# Altium schematic sheet ST_LINK_V3E.SchDoc: STLINK_V3E
size OrCAD A; Date: Not used; ApprovedBy: Not used; CheckedBy: Not used; Author: Not used; CompanyName: STMicroelectronics; DrawnBy: Not used; Engineer: Not used; Organization: Not used; Address1: Not used; Address2: Not used; Address3: Not used; Address4: Not used; DocumentNumber: 10; Revision: Not used; SheetNumber: 9; SheetTotal: 9; CurrentTime: Not used; CurrentDate: Not used; Time: Not used; DocumentFullPathAndName: Not used; DocumentName: Not used; ModifiedDate: Not used; ImagePath: Not used; ProjectName: Not used; Application_BuildNumber: Not used
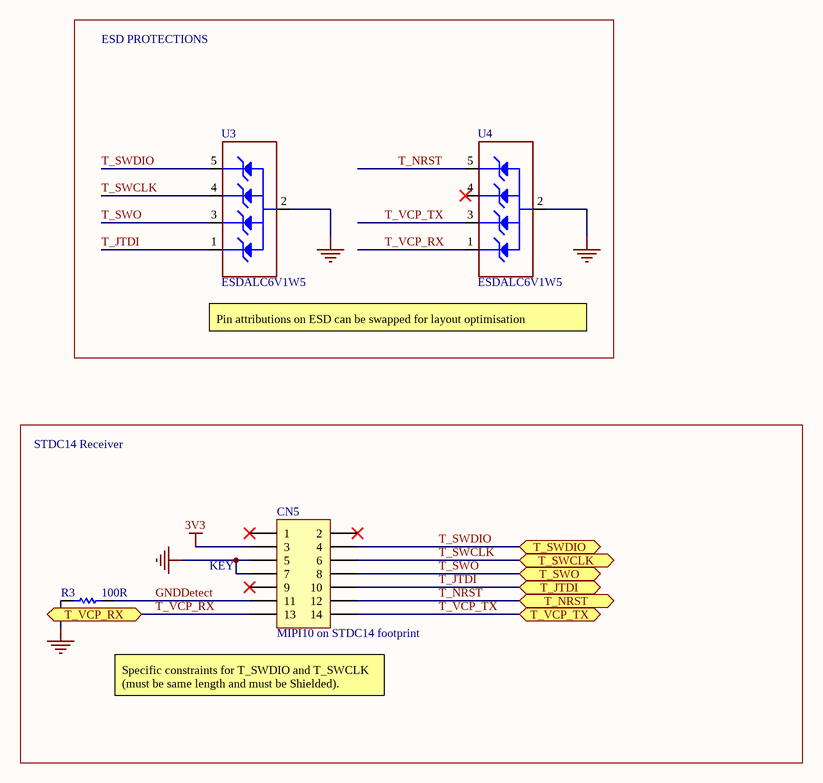
[diagram p0: ST_LINK_V3E.SchDoc]

## Parts
CN5  value MIPI10 on STDC14 footprint  [CON_STDC14_Receiver_MEDIUM_WITH_MIPI10_3D]  (hidden comment: Header 7x2)
R3  value 100R  [R0402]  (hidden comment: Resistor)
U3  ESDALC6V1W5  [ESD_SOT323-5L]
U4  ESDALC6V1W5  [ESD_SOT323-5L]

## Blocks framed on the sheet
ESD PROTECTIONS: U3 U4

## Ports
T_JTDI (bidir), T_NRST, T_SWCLK, T_SWDIO, T_SWO, T_VCP_RX, T_VCP_TX

## Nets
3V3: CN5.3
GND: CN5.5 CN5.7 R3.1 U3.2(GND) U4.2(GND)
GNDDetect: CN5.11 R3.2
T_JTDI: CN5.10 U3.1(IO1) ; port T_JTDI
T_NRST: CN5.12 U4.5(IO4) ; port T_NRST
T_SWCLK: CN5.6 U3.4(IO3) ; port T_SWCLK
T_SWDIO: CN5.4 U3.5(IO4) ; port T_SWDIO
T_SWO: CN5.8 U3.3(IO2) ; port T_SWO
T_VCP_RX: CN5.13 U4.1(IO1) ; port T_VCP_RX
T_VCP_TX: CN5.14 U4.3(IO2) ; port T_VCP_TX

Not connected (* = marked no-connect by the designer): CN5 1* 2* 9*; U4 4(IO3)*

## Notes on the sheet
- Pin attributions on ESD can be swapped for layout optimisation
- STDC14 Receiver
- (near CN5) KEY
- Specific constraints for T_SWDIO and T_SWCLK (must be same length and must be Shielded).
- Title
- Size:
- Date:
- Orcad A
- Number:
- Time:
- Revision:
- Sheet
- of
- ZLS Corporation
- 7801 North Lamar Blvd.
- Suite E-184
- Austin, Texas 78752  USA
- (512) 453-0288
- File:

## Library data of the parts
CN5 = MCD-01226: Header 5x2, 1.27mm, Dual row, Straight, Surface mount, vertical male connector. 3.05mm lead. Mates with FFSD connector. Footprint compatible with FTSH-107-01-L-DV,-K,-A,-P,-ES (STDC14 MEDIUM); Manufacturer_Part_Number: FTSH-105-01-L-DV-K; Manufacturer: SAMTEC; Alternate_Manufacturer_Part_Number: P127B-2x05MGF-079-1A; Alternate_Manufacturer: JIUBABA; Provided_By: SUBCO; Internal_Part_Number: MCD-01226; Status: Released; Part_Type: Connector; ComponentLink1Description: Datasheet; ComponentLink1URL: http://tunmcdsvn.tun.st.com/Component_Datasheet_Library/Trunk/Connectors/Samtec_FTSH_smt_series; ECCN_US: n/a; ECCN_EU: n/a
R3 = MCD-00119: Resistor,100R,0402,1%,1/16W; Manufacturer_Part_Number: RC0402FR-07100RL; Manufacturer: YAGEO; Provided_By: SUBCO; ECCN_US: EAR99; ECCN_EU: NEC; Internal_Part_Number: MCD-00119; Status: Released; Part_Type: Resistor; ComponentLink1Description: Datasheet; Package: R0402; ComponentLink1URL: http://tunmcdsvn.tun.st.com/Component_Datasheet_Library/Trunk/Resistors/Yageo_Resistor_RC0402-series
U3 U4 = MCD-00136: Dual Transil array for ESD protection; Part_Type: Diode; Manufacturer: STMICROELECTRONICS; BMS_Part_Number: 9151112; Provided_By: SUBCO with ST control; ECCN_US: EAR99; ECCN_EU: NEC; Internal_Part_Number: MCD-00136; Value: ESDALC6V1W5; Status: Released; Manufacturer_Part_Number: ESDALC6V1W5; ComponentLink1Description: Datasheet; ComponentLink1URL: http://tunmcdsvn.tun.st.com/Component_Datasheet_Library/Trunk/Diodes/STM_ESD_ESDALC6V1W5